# EAGLE design tappy_expander (EAGLE 6.5.0)

## Sheet 1 of 2
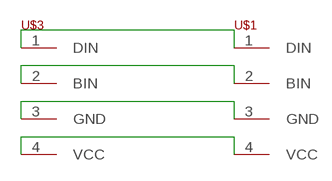
[diagram p0: schematic, sheet 1]

### Parts
U$1  4PAD_BIG  [4PAD_BIG]
U$3  4PAD  [4PAD]

### Nets
N$1: U$1.1(DIN) U$3.1(DIN)
N$2: U$1.2(BIN) U$3.2(BIN)
N$3: U$1.3(GND) U$3.3(GND)
N$4: U$1.4(VCC) U$3.4(VCC)

## Sheet 2 of 2

## Library data of the parts
U$1 = Sparky:4PAD_BIG
U$3 = Sparky:4PAD

## Board
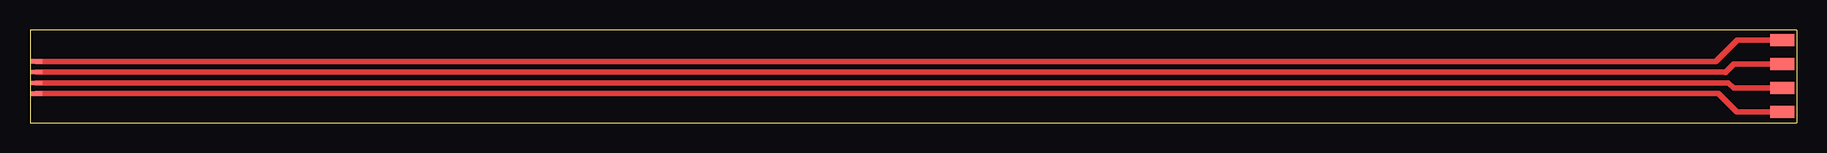
[diagram p1: board, top side]

Size 147.25 x 7.75 mm. Coordinates in mm from the lower left corner, seen from the top.
Outline: 0,7.75 0,0 147.25,0 147.25,7.75 0,7.75
Copper layers (1*16): Top 0.035mm / dielectric 1.5mm / Bottom 0.035mm
Design rules "default": minimum track width 10mil, minimum drill 24mil, track to track 8mil, track to pad 8mil, pad to pad 8mil, via to via 8mil, smd to smd 8mil, copper to edge 40mil, drill to drill 8mil, minimum pad ring 10mil, minimum via ring 8mil, stop-mask expansion 4mil, vias tented up to drill 0mil, thermal gap 10mil

### Footprints (pad centres in the part's own frame; a part is rotated, then mirrored left to right if it is on the bottom)
4PAD_BIG = smd 2 x 1: 1 1.25,6.75; 2 1.25,4.75; 3 1.25,2.75; 4 1.25,0.75
4PAD = smd 1 x 0.4: 1 0,0.3 | smd 1 x 0.35: 2 0,1.2; 3 0,2.1; 4 0,3

### Placement (x,y rotation side)
U$1  147.3,7.65 180 top
U$3  0.5,2.12 0 top

### Tracks (layer width: path | path; a pad name or v marks a point on that pad's centre or on a via)
N$1
  Top 0.45: U$3.1 140.72,2.42 142.25,0.9 U$1.1
N$2
  Top 0.45: U$3.2 141.57,3.33 142,2.9 U$1.2
N$3
  Top 0.45: U$1.3 142,4.9 141.3,4.2 141.28,4.22 U$3.3
N$4
  Top 0.45: U$3.4 140.53,5.12 142.3,6.9 U$1.4